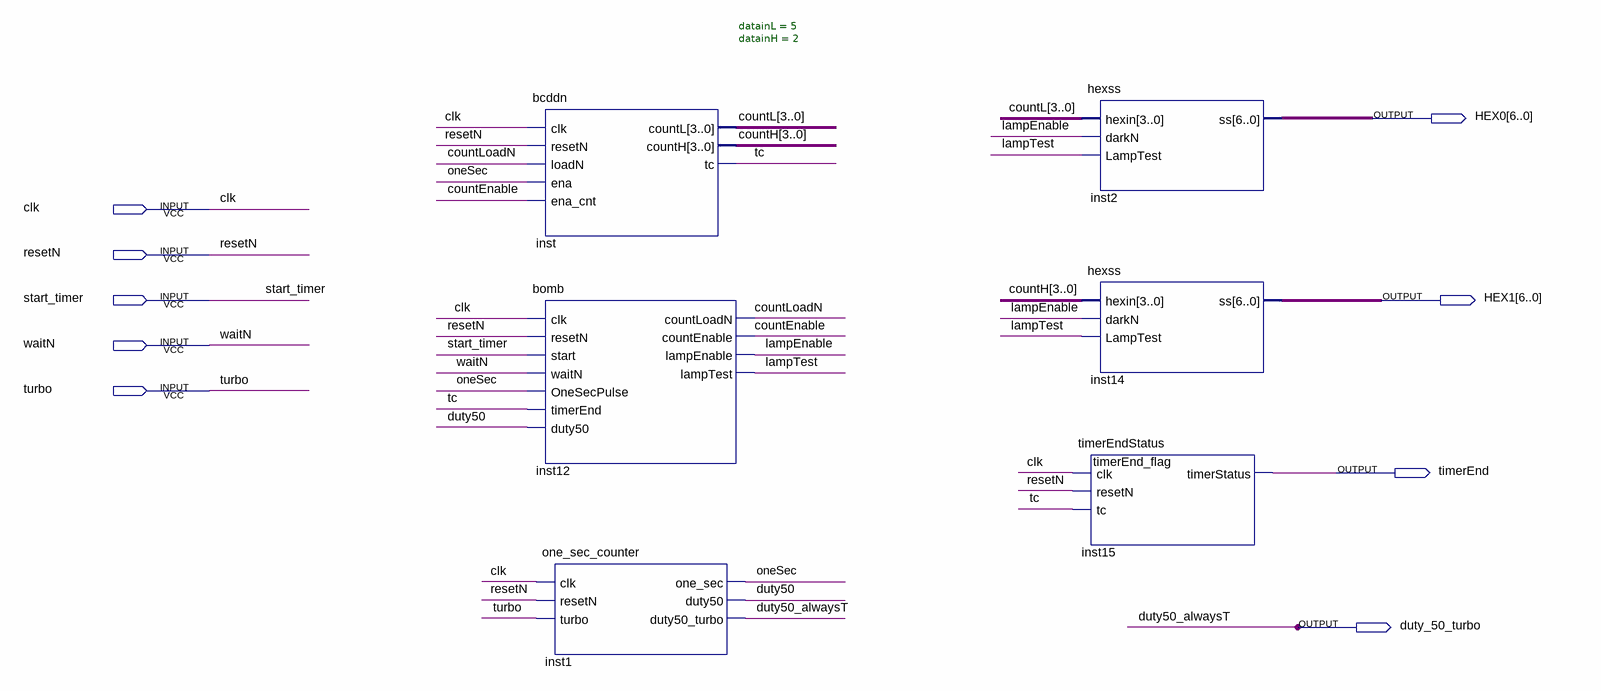
[diagram p0: schematic sheet]
// Quartus schematic timerBlock.bdf as structural Verilog: 6 symbols, 9 pins
module timerBlock (
  input  clk,
  input  resetN,
  input  start_timer,
  input  waitN,
  input  turbo,
  output [6:0] HEX0,
  output [6:0] HEX1,
  output timerEnd,
  output duty_50_turbo
);

  wire countEnable, countLoadN, duty50, lampEnable, lampTest, oneSec, tc;
  wire [3:0] countH, countL;

  bcddn #(.datainL(5), .datainH(2)) inst (
    .clk(clk), .resetN(resetN), .loadN(countLoadN), .ena(oneSec), .ena_cnt(countEnable), .countL(countL),
    .countH(countH), .tc(tc));
  bomb inst12 (
    .clk(clk), .resetN(resetN), .start(start_timer), .waitN(waitN), .OneSecPulse(oneSec), .timerEnd(tc),
    .duty50(duty50), .countLoadN(countLoadN), .countEnable(countEnable), .lampEnable(lampEnable),
    .lampTest(lampTest));
  one_sec_counter inst1 (
    .clk(clk), .resetN(resetN), .turbo(turbo), .one_sec(oneSec), .duty50(duty50), .duty50_turbo(duty_50_turbo));
  hexss inst2 (.hexin(countL), .darkN(lampEnable), .LampTest(lampTest), .ss(HEX0));
  hexss inst14 (.hexin(countH), .darkN(lampEnable), .LampTest(lampTest), .ss(HEX1));
  timerEndStatus inst15 (.clk(clk), .resetN(resetN), .tc(tc), .timerStatus(timerEnd));

  // Other names for the same wires on the sheet: duty50_alwaysT = duty_50_turbo; timerEnd_flag = timerEnd
endmodule
